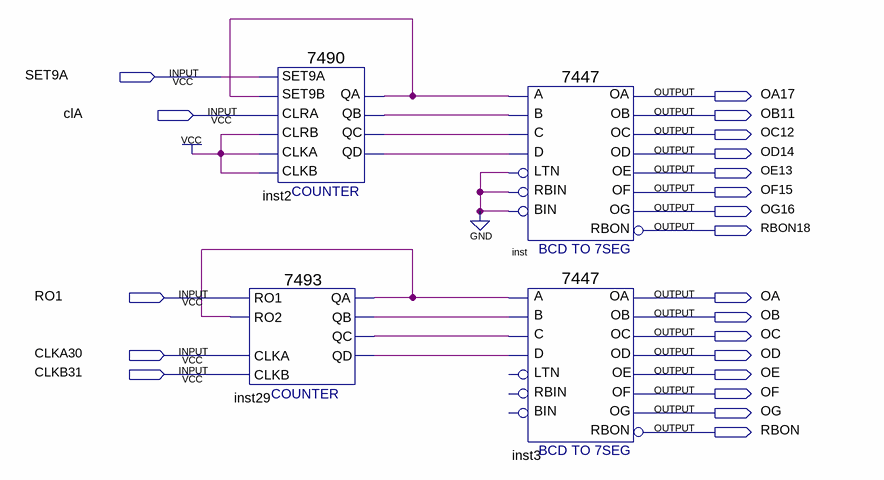
[diagram p0: schematic sheet]
// Quartus schematic Proy1.bdf as structural Verilog: 4 symbols, 21 pins
module Proy1 (
  input  SET9A,
  input  clA,
  input  RO1,
  input  CLKA30,
  input  CLKB31,
  output OA17,
  output OB11,
  output OC12,
  output OD14,
  output OE13,
  output OF15,
  output OG16,
  output RBON18,
  output OA,
  output OB,
  output OC,
  output OD,
  output OE,
  output OF,
  output OG,
  output RBON
);

  wire inst2_qa, inst2_qb, inst2_qc, inst2_qd, inst29_qa, inst29_qb, inst29_qc, inst29_qd;

  \7493  inst29 (
    .RO1(RO1), .RO2(inst29_qa), .CLKA(CLKA30), .CLKB(CLKB31), .QC(inst29_qc), .QB(inst29_qb), .QA(inst29_qa),
    .QD(inst29_qd));
  \7490  inst2 (
    .SET9A(SET9A), .CLRA(clA), .SET9B(inst2_qa), .CLKB(1'b1), .CLKA(1'b1), .CLRB(1'b1), .QD(inst2_qd),
    .QA(inst2_qa), .QB(inst2_qb), .QC(inst2_qc));
  \7447  inst (
    .LTN(1'b0), .B(inst2_qb), .C(inst2_qc), .D(inst2_qd), .RBIN(1'b0), .BIN(1'b0), .A(inst2_qa), .OB(OB11),
    .OC(OC12), .OE(OE13), .OD(OD14), .OF(OF15), .OG(OG16), .OA(OA17), .RBON(RBON18));
  \7447  inst3 (
    .B(inst29_qb), .C(inst29_qc), .D(inst29_qd), .A(inst29_qa), .OB(OB), .OC(OC), .OE(OE), .OD(OD), .OF(OF),
    .OG(OG), .OA(OA), .RBON(RBON));  // open: LTN, RBIN, BIN
endmodule
